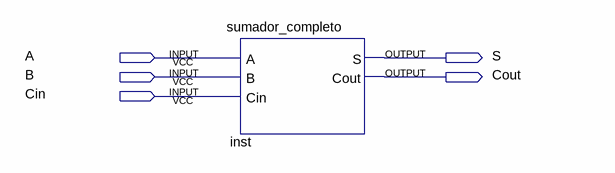
[diagram p0: schematic sheet]
// Quartus schematic Block2.bdf as structural Verilog: 1 symbols, 5 pins
module Block2 (
  input  A,
  input  B,
  input  Cin,
  output S,
  output Cout
);

  sumador_completo inst (.A(A), .B(B), .Cin(Cin), .S(S), .Cout(Cout));
endmodule
